# EAGLE schematic fCPU (EAGLE 7.6.0)
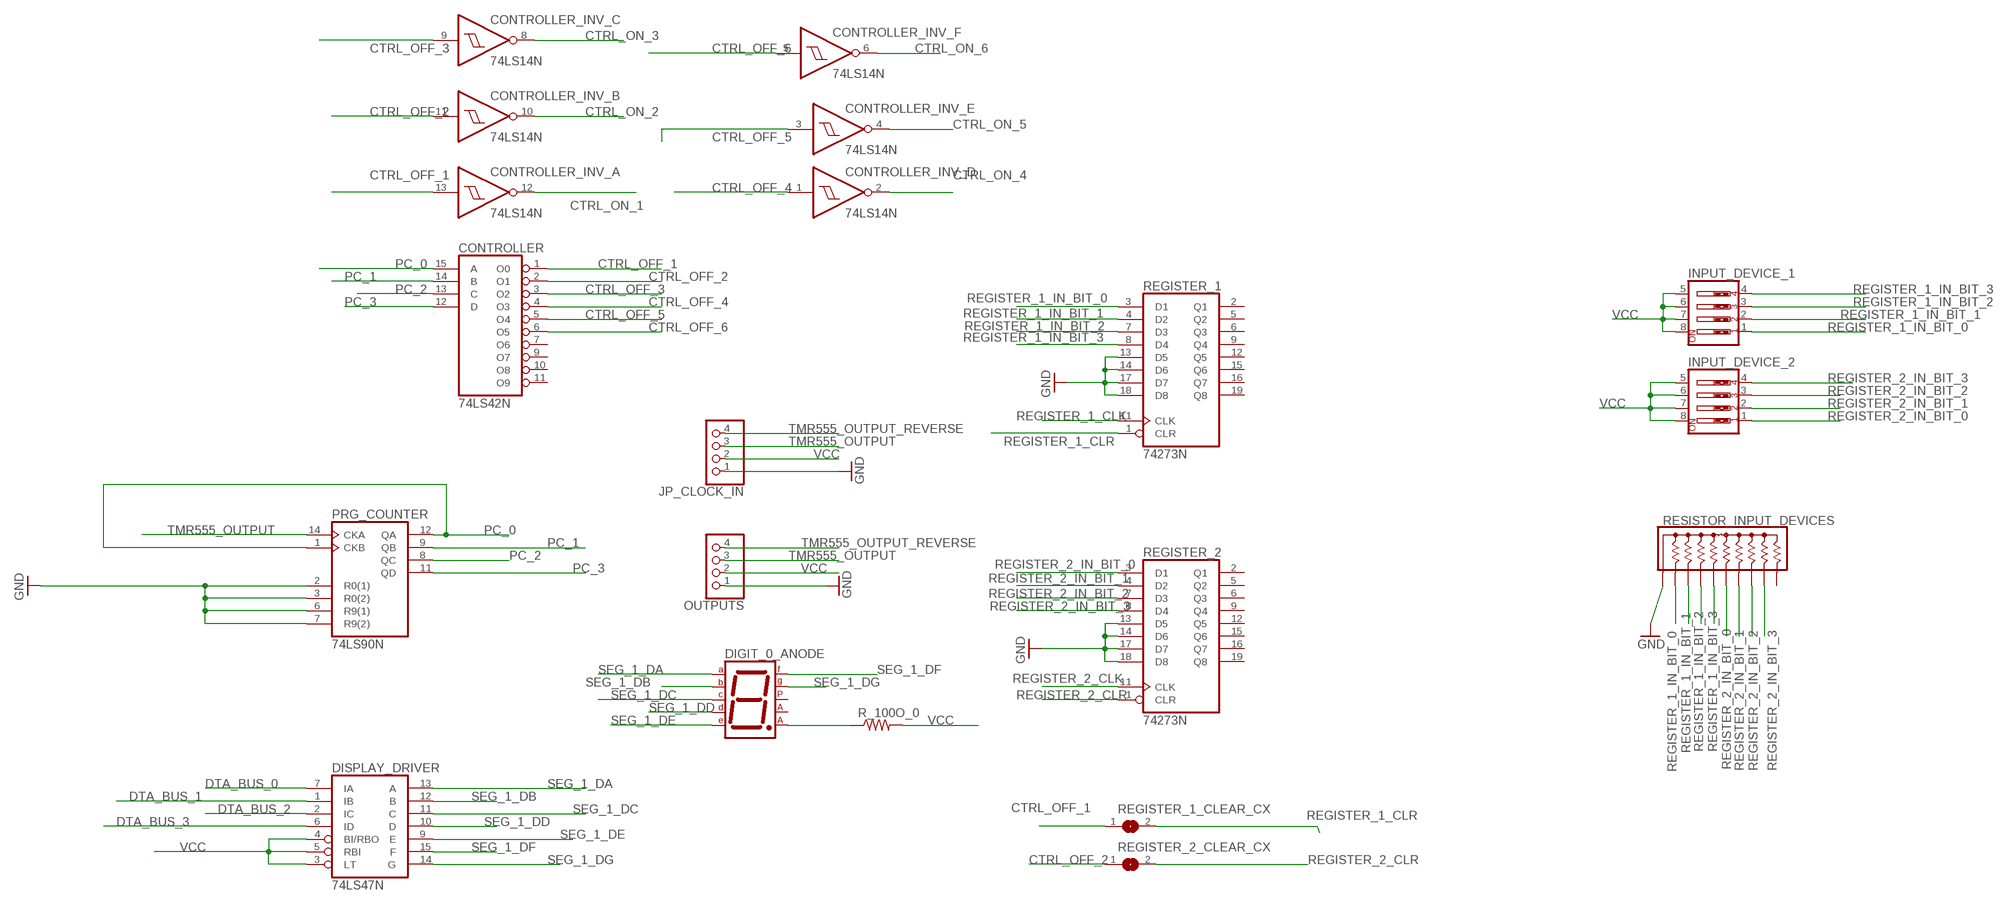
[diagram p0: schematic, sheet 1]

## Parts
CONTROLLER  74LS42N  [DIL16]
CONTROLLER_INV_  74LS14N  [DIL14]
DIGIT_0_ANODE  7SEG-CA  [7SEG-13]
DISPLAY_DRIVER  74LS47N  [DIL16]
INPUT_DEVICE_1  SW_DIP-4  [EDG-04]
INPUT_DEVICE_2  SW_DIP-4  [EDG-04]
JP_CLOCK_IN  PINHD-1X4  [1X04]
OUTPUTS  PINHD-1X4  [1X04]
PRG_COUNTER  74LS90N  [DIL14]
R_100O_0  R-US_R1206  [R1206]
REGISTER_1  74273N  [DIL20]
REGISTER_1_CLEAR_CX  SOLDERJUMPERREFLOW  [SOLDERJUMPER_REFLOW]
REGISTER_2  74273N  [DIL20]
REGISTER_2_CLEAR_CX  SOLDERJUMPERREFLOW  [SOLDERJUMPER_REFLOW]
RESISTOR_INPUT_DEVICES  4610X  [SIP10]

## Nets
CTRL_OFF_1: CONTROLLER.1(O0) CONTROLLER_INV_.13(A:I) REGISTER_1_CLEAR_CX.1
CTRL_OFF_2: CONTROLLER.2(O1) CONTROLLER_INV_.11(B:I) REGISTER_2_CLEAR_CX.1
CTRL_OFF_3: CONTROLLER.3(O2) CONTROLLER_INV_.9(C:I)
CTRL_OFF_4: CONTROLLER.4(O3) CONTROLLER_INV_.1(D:I)
CTRL_OFF_5: CONTROLLER.5(O4) CONTROLLER_INV_.3(E:I)
CTRL_OFF_6: CONTROLLER.6(O5) CONTROLLER_INV_.5(F:I)
CTRL_ON_1: CONTROLLER_INV_.12(A:O)
CTRL_ON_2: CONTROLLER_INV_.10(B:O)
CTRL_ON_3: CONTROLLER_INV_.8(C:O)
CTRL_ON_4: CONTROLLER_INV_.2(D:O)
CTRL_ON_5: CONTROLLER_INV_.4(E:O)
CTRL_ON_6: CONTROLLER_INV_.6(F:O)
DTA_BUS_0: DISPLAY_DRIVER.7(IA)
DTA_BUS_1: DISPLAY_DRIVER.1(IB)
DTA_BUS_2: DISPLAY_DRIVER.2(IC)
DTA_BUS_3: DISPLAY_DRIVER.6(ID)
GND: JP_CLOCK_IN.1 OUTPUTS.1 PRG_COUNTER.2(R0(1)) PRG_COUNTER.3(R0(2)) PRG_COUNTER.6(R9(1)) PRG_COUNTER.7(R9(2)) REGISTER_1.13(D5) REGISTER_1.14(D6) REGISTER_1.17(D7) REGISTER_1.18(D8) REGISTER_2.13(D5) REGISTER_2.14(D6) REGISTER_2.17(D7) REGISTER_2.18(D8) RESISTOR_INPUT_DEVICES.1
N$1: DIGIT_0_ANODE.8(CA2) R_100O_0.1
PC_0: CONTROLLER.15(A) PRG_COUNTER.1(CKB) PRG_COUNTER.12(QA)
PC_1: CONTROLLER.14(B) PRG_COUNTER.9(QB)
PC_2: CONTROLLER.13(C) PRG_COUNTER.8(QC)
PC_3: CONTROLLER.12(D) PRG_COUNTER.11(QD)
REGISTER_1_CLK: REGISTER_1.11(CLK)
REGISTER_1_CLR: REGISTER_1.1(CLR) REGISTER_1_CLEAR_CX.2
REGISTER_1_IN_BIT_0: INPUT_DEVICE_1.1 REGISTER_1.3(D1) RESISTOR_INPUT_DEVICES.2
REGISTER_1_IN_BIT_1: INPUT_DEVICE_1.2 REGISTER_1.4(D2) RESISTOR_INPUT_DEVICES.3
REGISTER_1_IN_BIT_2: INPUT_DEVICE_1.3 REGISTER_1.7(D3) RESISTOR_INPUT_DEVICES.4
REGISTER_1_IN_BIT_3: INPUT_DEVICE_1.4 REGISTER_1.8(D4) RESISTOR_INPUT_DEVICES.5
REGISTER_2_CLK: REGISTER_2.11(CLK)
REGISTER_2_CLR: REGISTER_2.1(CLR) REGISTER_2_CLEAR_CX.2
REGISTER_2_IN_BIT_0: INPUT_DEVICE_2.1 REGISTER_2.3(D1) RESISTOR_INPUT_DEVICES.6
REGISTER_2_IN_BIT_1: INPUT_DEVICE_2.2 REGISTER_2.4(D2) RESISTOR_INPUT_DEVICES.7
REGISTER_2_IN_BIT_2: INPUT_DEVICE_2.3 REGISTER_2.7(D3) RESISTOR_INPUT_DEVICES.8
REGISTER_2_IN_BIT_3: INPUT_DEVICE_2.4 REGISTER_2.8(D4) RESISTOR_INPUT_DEVICES.9
SEG_1_DA: DIGIT_0_ANODE.7(A) DISPLAY_DRIVER.13(A)
SEG_1_DB: DIGIT_0_ANODE.6(B) DISPLAY_DRIVER.12(B)
SEG_1_DC: DIGIT_0_ANODE.4(C) DISPLAY_DRIVER.11(C)
SEG_1_DD: DIGIT_0_ANODE.2(D) DISPLAY_DRIVER.10(D)
SEG_1_DE: DIGIT_0_ANODE.1(E) DISPLAY_DRIVER.9(E)
SEG_1_DF: DIGIT_0_ANODE.9(F) DISPLAY_DRIVER.15(F)
SEG_1_DG: DIGIT_0_ANODE.10(G) DISPLAY_DRIVER.14(G)
TMR555_OUTPUT: JP_CLOCK_IN.3 OUTPUTS.3 PRG_COUNTER.14(CKA)
TMR555_OUTPUT_REVERSE: JP_CLOCK_IN.4 OUTPUTS.4
VCC: DISPLAY_DRIVER.3(LT) DISPLAY_DRIVER.4(BI/RBO) DISPLAY_DRIVER.5(RBI) INPUT_DEVICE_1.5 INPUT_DEVICE_1.6 INPUT_DEVICE_1.7 INPUT_DEVICE_1.8 INPUT_DEVICE_2.5 INPUT_DEVICE_2.6 INPUT_DEVICE_2.7 INPUT_DEVICE_2.8 JP_CLOCK_IN.2 OUTPUTS.2 R_100O_0.2
Unconnected: CONTROLLER.7(O6) CONTROLLER.9(O7) CONTROLLER.10(O8) CONTROLLER.11(O9) DIGIT_0_ANODE.3(CA1) DIGIT_0_ANODE.5(DP) REGISTER_1.2(Q1) REGISTER_1.5(Q2) REGISTER_1.6(Q3) REGISTER_1.9(Q4) REGISTER_1.12(Q5) REGISTER_1.15(Q6) REGISTER_1.16(Q7) REGISTER_1.19(Q8) REGISTER_2.2(Q1) REGISTER_2.5(Q2) REGISTER_2.6(Q3) REGISTER_2.9(Q4) REGISTER_2.12(Q5) REGISTER_2.15(Q6) REGISTER_2.16(Q7) REGISTER_2.19(Q8) RESISTOR_INPUT_DEVICES.10

## Power pins joined to a net without a drawn wire
GND: CONTROLLER.8(GND) CONTROLLER_INV_.7(P:GND) DISPLAY_DRIVER.8(GND) PRG_COUNTER.10(GND) REGISTER_1.10(GND) REGISTER_2.10(GND)
VCC: CONTROLLER.16(VCC) CONTROLLER_INV_.14(P:VCC) DISPLAY_DRIVER.16(VCC) PRG_COUNTER.5(VCC) REGISTER_1.20(VCC) REGISTER_2.20(VCC)

## Library data of the parts
CONTROLLER = 74xx-us:74*42: 4-line to 10-line DECODER (1-of-10)
CONTROLLER_INV_ = 74xx-us:74*14: Hex schmitt trigger INVERTER
DIGIT_0_ANODE = special:7SEG-CA: 7-segment DISPLAY single anode, 13 mm
DISPLAY_DRIVER = 74xx-us:74*47: BCD to seven segment DECODER/DRIVER Source: http://www.ee.washington.edu/stores/DataSheets/74ls/74ls47.pdf
INPUT_DEVICE_1 INPUT_DEVICE_2 = special:SW_DIP-4: DIP SWITCH
JP_CLOCK_IN OUTPUTS = pinhead:PINHD-1X4: PIN HEADER
PRG_COUNTER = 74xx-us:74*90: Decade, divide by twelve and binary COUNTER
R_100O_0 = adafruit:R-US_: RESISTOR, American symbol
REGISTER_1 REGISTER_2 = 74xx-us:74*273: Octal D type FLIP FLOP, clear
REGISTER_1_CLEAR_CX REGISTER_2_CLEAR_CX = microbuilder:SOLDERJUMPER: SMD Solder JUMPER Solder the two pads together to create a connection, or remove the solder to break it. REFLOW - Use this footprint for solder paste and reflow ovens. WAVE - Use this footprint for hand-soldering (larger pads). CLOSED - Has a trace between the two pads to ensure it is closed by default. The trace needs to be cut to disable the jumper, and can be closed again by creating a solder bridge between the two pads.
RESISTOR_INPUT_DEVICES = resistor-sip:4610X: Bourns 4600X Series - Thick Film Conformal SIPs 4610X-101 Resistor Network Configuration: 101 (Bussed Resistors) Resistance range: 10 ohms to 10 Megaohms Maximum Operating Voltage: 100V Source: http://www.bourns.com/ProductLine.aspx?name=standard_thick_film_networks PDF: http://www.bourns.com/data/global/pdfs/4600X.pdf